# EAGLE design gecko (EAGLE 5.11)

## Sheet 1 of 3
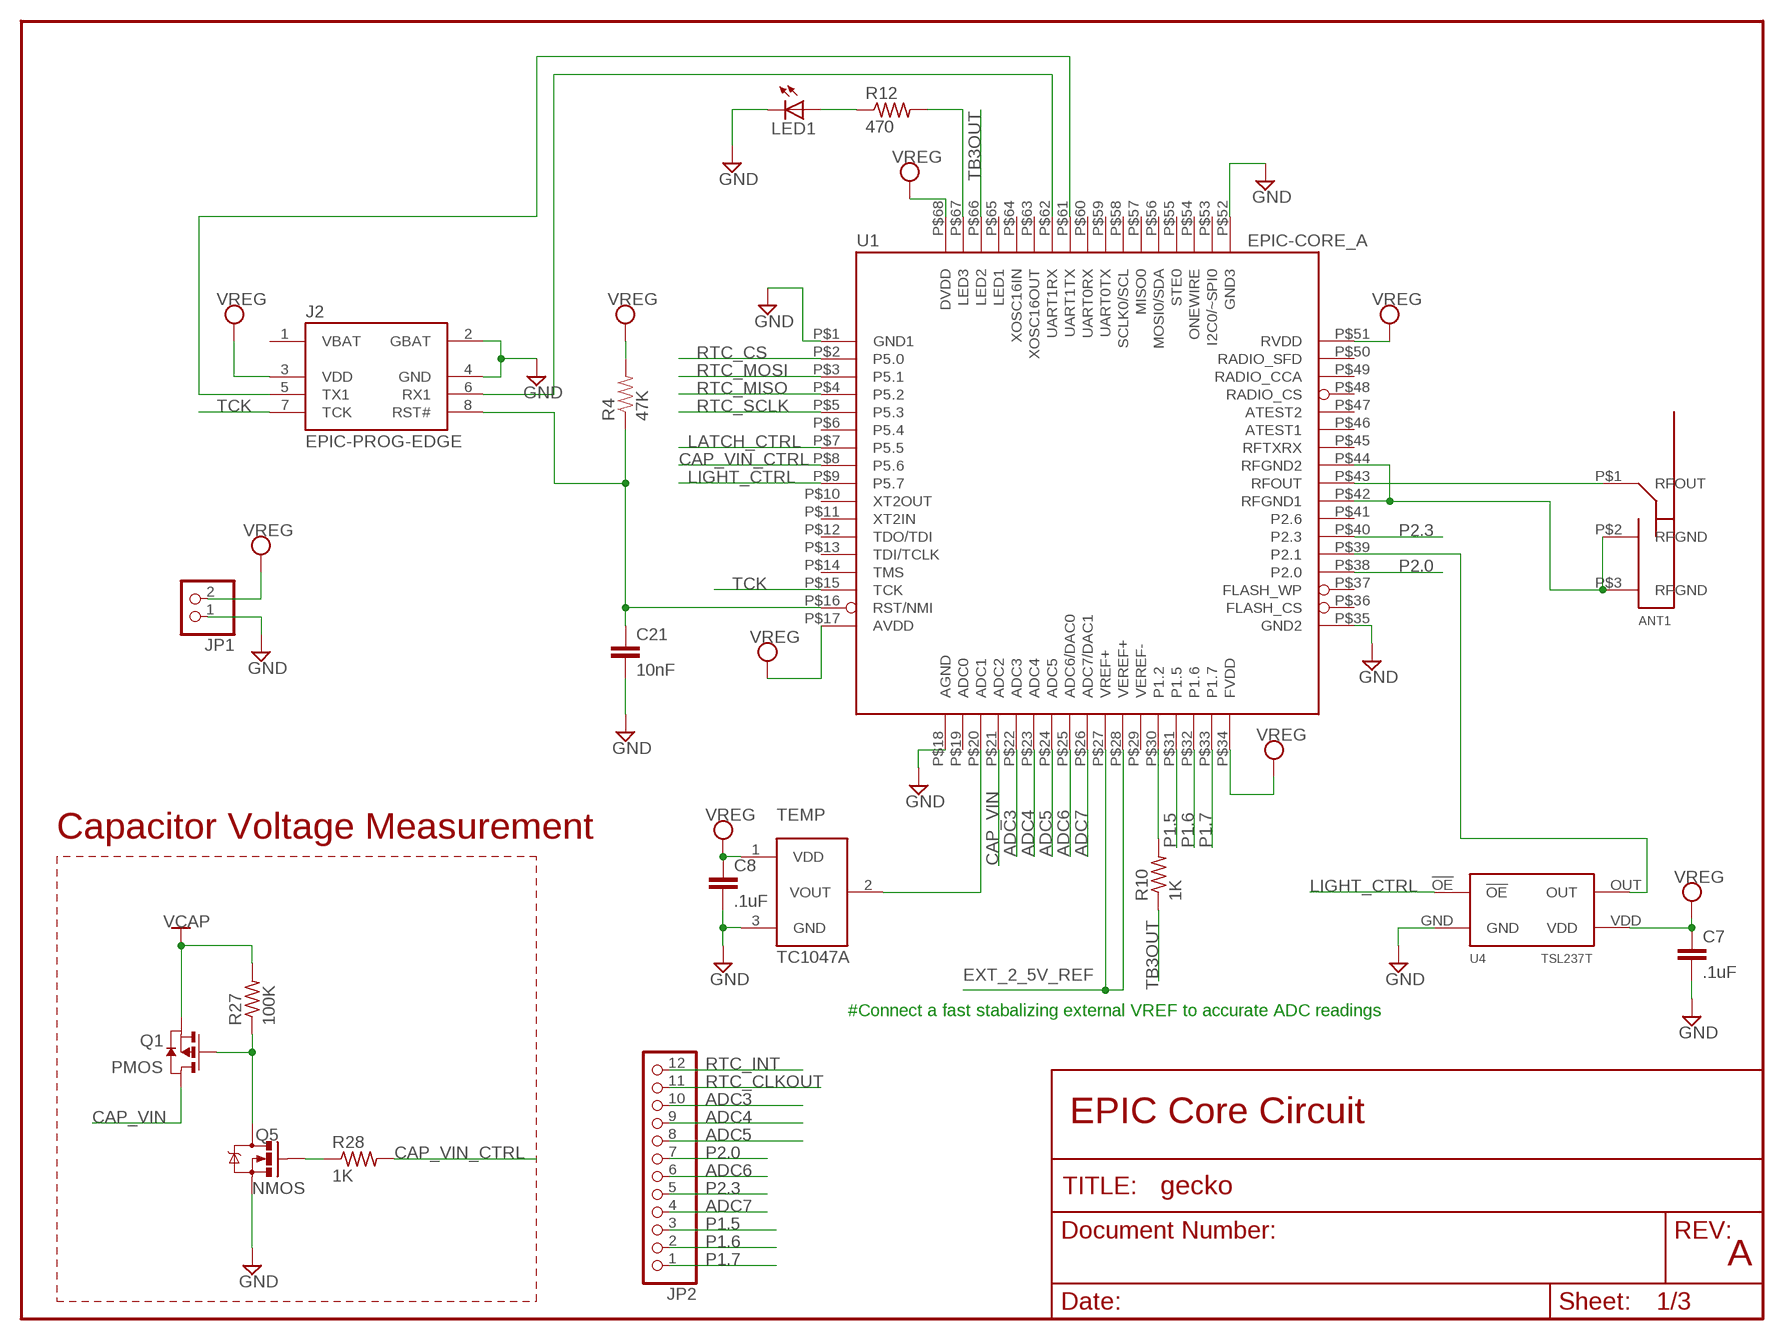
[diagram p0: schematic, sheet 1]

### Parts
ANT1  PIFA-2.4GHZ  [PIFA-2.4GHZ]
C7  .1uF  CAPACITOR  [C0603B]
C8  .1uF  CAPACITOR  [C0603B]
C21  10nF  CAPACITOR  [C0603B]
J2  EPIC-PROG-EDGE  [EPIC-PROG-EDGE]
JP1  PINHD-1X2M  [1X02M]
JP2  PINHD-1X12M  [1X12M]
LED1  LED0603  [LED-0603]
Q1  PMOS  PMOSSOT23  [SOT-23]
Q5  NMOS  MOSFET-NCHANNELSMD  [SOT23-3]
R4  47K  RESISTOR0603-RES  [0603-RES]
R10  1K  RESISTOR  [R0603B]
R12  470  RESISTOR  [R0603B]
R27  100K  RESISTOR  [R0603B]
R28  1K  RESISTOR  [R0603B]
TEMP  TC1047A  [SOT-23-3]
U1  EPIC-CORE_A  [EPIC-LCC68]
U4  TSL237T  [T_4LEAD]

### Nets
ADC3: JP2.10 U1.P$22(ADC3)
ADC4: JP2.9 U1.P$23(ADC4)
ADC5: JP2.8 U1.P$24(ADC5)
ADC6: JP2.6 U1.P$25(ADC6/DAC0)
ADC7: JP2.4 U1.P$26(ADC7/DAC1)
CAP_VIN: Q1.1(D) U1.P$21(ADC2)
CAP_VIN_CTRL: R28.2 U1.P$8(P5.6)
EXT_2_5V_REF: U1.P$27(VREF+) U1.P$28(VEREF+)
GND: C7.2 C8.2 C21.2 J2.2(GBAT) J2.4(GND) JP1.1 LED1.C Q5.2(S) TEMP.3(GND) U1.P$1(GND1) U1.P$18(AGND) U1.P$35(GND2) U1.P$52(GND3) U4.GND ; also sheet 2,3
LATCH_CTRL: U1.P$7(P5.5) ; also sheet 2
LIGHT_CTRL: U1.P$9(P5.7) U4.!OE
LIGHT_FREQ_IN: U1.P$39(P2.1) U4.OUT
N$1: ANT1.P$1(RFOUT) U1.P$43(RFOUT)
N$6: Q1.3(G) Q5.3(D) R27.1
N$7: J2.6(RX1) U1.P$62(UART1RX)
N$8: R10.2 U1.P$30(P1.2)
N$11: J2.5(TX1) U1.P$61(UART1TX)
N$12: Q5.1(G) R28.1
N$14: R12.2 U1.P$67(LED3)
N$15: LED1.A R12.1
N$17: C21.1 J2.8(RST#) R4.1 U1.P$16(RST/NMI)
N$20: TEMP.2(VOUT) U1.P$20(ADC1)
P1.5: JP2.3 U1.P$31(P1.5)
P1.6: JP2.2 U1.P$32(P1.6)
P1.7: JP2.1 U1.P$33(P1.7)
P2.0: JP2.7 U1.P$38(P2.0)
P2.3: JP2.5 U1.P$40(P2.3)
RFGND: ANT1.P$2(RFGND) ANT1.P$3(RFGND) U1.P$42(RFGND1) U1.P$44(RFGND2)
RTC_CLKOUT: JP2.11 ; also sheet 3
RTC_CS: U1.P$2(P5.0) ; also sheet 3
RTC_INT: JP2.12 ; also sheet 2,3
RTC_MISO: U1.P$4(P5.2) ; also sheet 3
RTC_MOSI: U1.P$3(P5.1) ; also sheet 3
RTC_SCLK: U1.P$5(P5.3) ; also sheet 3
TB3OUT: R10.1 U1.P$66(LED2)
TCK: J2.7(TCK) U1.P$15(TCK)
VCAP: Q1.2(S) R27.2 ; also sheet 2
VREG: C7.1 C8.1 J2.3(VDD) JP1.2 R4.2 TEMP.1(VDD) U1.P$17(AVDD) U1.P$34(FVDD) U1.P$51(RVDD) U1.P$68(DVDD) U4.VDD ; also sheet 2,3
Unconnected: J2.1(VBAT) U1.P$6(P5.4) U1.P$10(XT2OUT) U1.P$11(XT2IN) U1.P$12(TDO/TDI) U1.P$13(TDI/TCLK) U1.P$14(TMS) U1.P$19(ADC0) U1.P$29(VEREF-) U1.P$36(FLASH_CS) U1.P$37(FLASH_WP) U1.P$41(P2.6) U1.P$45(RFTXRX) U1.P$46(ATEST1) U1.P$47(ATEST2) U1.P$48(RADIO_CS) U1.P$49(RADIO_CCA) U1.P$50(RADIO_SFD) U1.P$53(I2C0/~SPI0) U1.P$54(ONEWIRE) U1.P$55(STE0) U1.P$56(MOSI0/SDA) U1.P$57(MISO0) U1.P$58(SCLK0/SCL) U1.P$59(UART0TX) U1.P$60(UART0RX) U1.P$63(XOSC16OUT) U1.P$64(XOSC16IN) U1.P$65(LED1)

### Notes on the sheet
- Capacitor Voltage Measurement
- #Connect a fast stabalizing external VREF to accurate ADC readings
- EPIC Core Circuit
- A

## Sheet 2 of 3
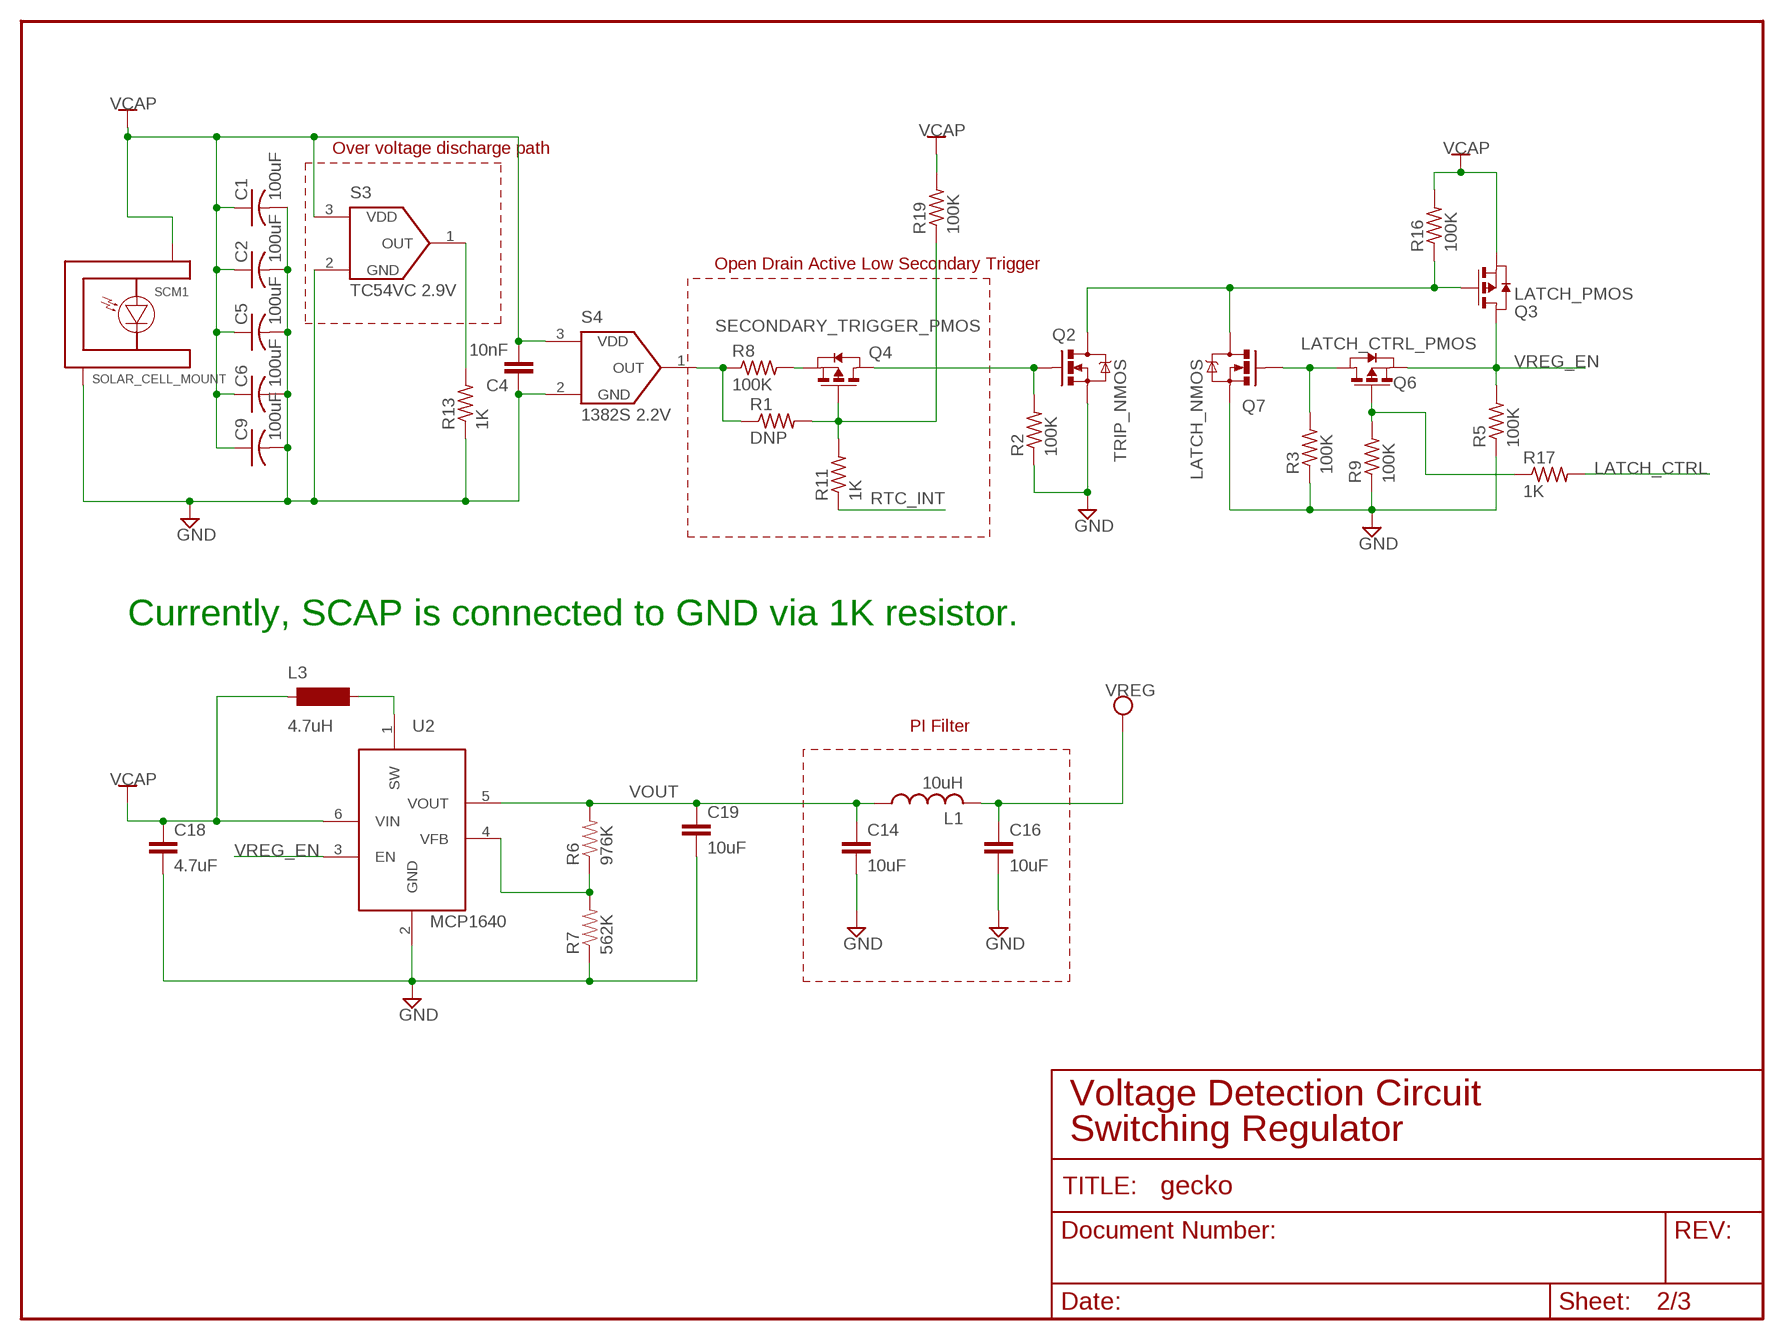
[diagram p1: schematic, sheet 2]

### Parts
C1  100uF  C-USC1206  [C1206]
C2  100uF  C-USC1206  [C1206]
C4  10nF  CAPACITOR  [C0603B]
C5  100uF  C-USC1206  [C1206]
C6  100uF  C-USC1206  [C1206]
C9  100uF  C-USC1206  [C1206]
C14  10uF  CAP0805  [0805]
C16  10uF  CAP0805  [0805]
C18  4.7uF  CAP0603-CAP  [0603-CAP]
C19  10uF  CAP0805  [0805]
L1  10uH  L-USL2012C  [L2012C]
L3  4.7uH  INDUCTOR  [INDUCTOR]
Q2  TRIP_NMOS  MOSFET-NCHANNELSMD  [SOT23-3]
Q3  LATCH_PMOS  PMOSSOT23  [SOT-23]
Q4  SECONDARY_TRIGGER_PMOS  PMOSSOT23  [SOT-23]
Q6  LATCH_CTRL_PMOS  PMOSSOT23  [SOT-23]
Q7  LATCH_NMOS  MOSFET-NCHANNELSMD  [SOT23-3]
R1  DNP  RESISTOR  [R0603B]
R2  100K  RESISTOR  [R0603B]
R3  100K  RESISTOR  [R0603B]
R5  100K  RESISTOR  [R0603B]
R6  976K  RESISTOR0603-RES  [0603-RES]
R7  562K  RESISTOR0603-RES  [0603-RES]
R8  100K  RESISTOR  [R0603B]
R9  100K  RESISTOR  [R0603B]
R11  1K  RESISTOR  [R0603B]
R13  1K  RESISTOR  [R0603B]
R16  100K  RESISTOR  [R0603B]
R17  1K  RESISTOR  [R0603B]
R19  100K  RESISTOR  [R0603B]
S3  TC54VC 2.9V  1382  [SOT-23-3A]
S4  1382S 2.2V  1382  [SOT-23-3A]
SCM1  SOLAR_CELL_MOUNT  [SOLAR_CELL_MOUNT]
U2  MCP1640  [SOT-23-6]

### Nets
GND: C1.2 C2.2 C4.1 C5.2 C6.2 C9.2 C14.2 C16.2 C18.2 C19.2 Q2.2(S) Q7.2(S) R2.1 R3.1 R5.1 R7.1 R9.1 R13.1 S3.2(GND) S4.2(GND) SCM1.NEG U2.2(GND) ; also sheet 1,3
LATCH_CTRL: R17.2 ; also sheet 1
N$2: Q2.1(G) Q4.1(D) R2.2
N$3: L3.2 U2.1(SW)
N$4: R1.1 R8.1 S4.1(OUT)
N$5: R6.1 R7.2 U2.4(VFB)
N$9: Q2.3(D) Q3.3(G) Q7.3(D) R16.1
N$10: Q4.2(S) R8.2
N$13: R13.2 S3.1(OUT)
N$23: Q6.1(D) Q7.1(G) R3.2
N$24: Q6.3(G) R9.2 R17.1
N$25: Q4.3(G) R1.2 R11.2 R19.1
RTC_INT: R11.1 ; also sheet 1,3
VCAP: C1.1 C2.1 C4.2 C5.1 C6.1 C9.1 C18.1 L3.1 Q3.2(S) R16.2 R19.2 S3.3(VDD) S4.3(VDD) SCM1.POS U2.6(VIN) ; also sheet 1
VOUT: C14.1 C19.1 L1.1 R6.2 U2.5(VOUT)
VREG: C16.1 L1.2 ; also sheet 1,3
VREG_EN: Q3.1(D) Q6.2(S) R5.2 U2.3(EN)

### Notes on the sheet
- Over voltage discharge path
- Open Drain Active Low Secondary Trigger
- Currently, SCAP is connected to GND via 1K resistor.
- PI Filter
- Voltage Detection Circuit
- Switching Regulator

## Sheet 3 of 3
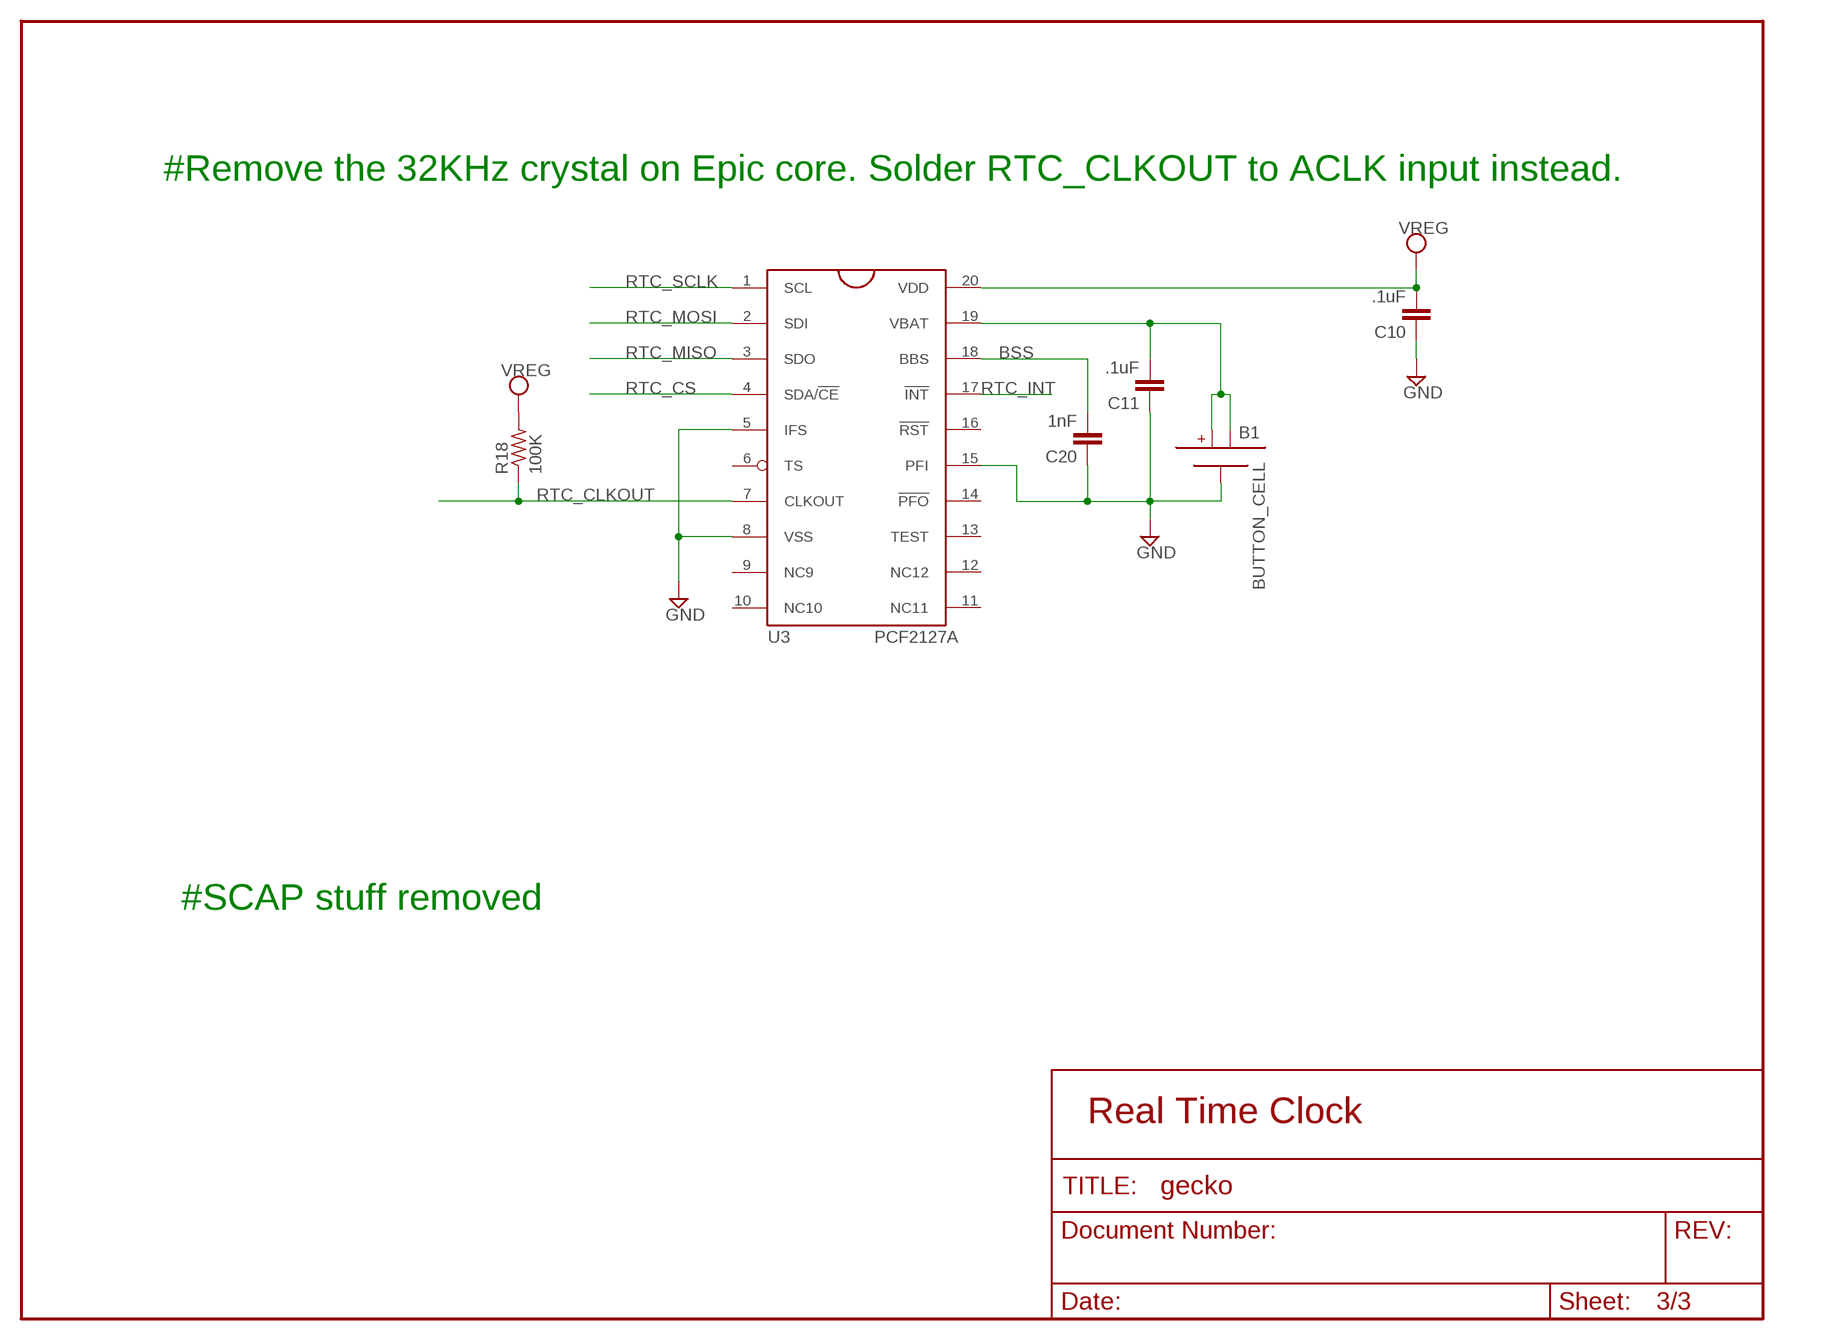
[diagram p2: schematic, sheet 3]

### Parts
B1  BUTTON_CELL  [RETAINER_3000]
C10  .1uF  CAP0603-CAP  [0603-CAP]
C11  .1uF  CAP0603-CAP  [0603-CAP]
C20  1nF  CAP0603-CAP  [0603-CAP]
R18  100K  R-US_R0603  [R0603]
U3  PCF2127A  [SO-20]

### Nets
BSS: C20.2 U3.18(BBS)
GND: B1.NEG C10.1 C11.1 C20.1 U3.5(IFS) U3.8(VSS) U3.15(PFI) ; also sheet 1,2
N$28: B1.POS1 B1.POS2 C11.2 U3.19(VBAT)
RTC_CLKOUT: R18.1 U3.7(CLKOUT) ; also sheet 1
RTC_CS: U3.4(SDA/!CE) ; also sheet 1
RTC_INT: U3.17(!INT) ; also sheet 1,2
RTC_MISO: U3.3(SDO) ; also sheet 1
RTC_MOSI: U3.2(SDI) ; also sheet 1
RTC_SCLK: U3.1(SCL) ; also sheet 1
VREG: C10.2 R18.2 U3.20(VDD) ; also sheet 1,2
Unconnected: U3.6(TS) U3.9(NC9) U3.10(NC10) U3.11(NC11) U3.12(NC12) U3.13(TEST) U3.14(!PFO) U3.16(!RST)

### Notes on the sheet
- #Remove the 32KHz crystal on Epic core. Solder RTC_CLKOUT to ACLK input instead.
- #SCAP stuff removed
- Real Time Clock

## Library data of the parts
ANT1 = berkeley-epic:PIFA-2.4GHZ
B1 = mylibrary:BUTTON_CELL
C1 C2 C5 C6 C9 = rcl:C-US: CAPACITOR, American symbol
C4 C7 C8 C21 = Gecko:CAPACITOR
C10 C11 C14 C16 C18-C20 = SparkFun:CAP: Capacitor Standard 0603 ceramic capacitor, and 0.1" leaded capacitor.
J2 = berkeley-epic:EPIC-PROG-EDGE
JP1 = pinhead:PINHD-1X2: PIN HEADER
JP2 = pinhead:PINHD-1X12: PIN HEADER
L1 = rcl:L-US: INDUCTOR, American symbol
L3 = mylibrary:INDUCTOR
LED1 = SparkFun:LED: LEDs Standard schematic elements and footprints for 5mm, 3mm, 1206, and 0603 sized LEDs. 5mm - Spark Fun Electronics SKU : COM-00529 (and others)
Q1 Q3 Q4 Q6 = berkeley-epic:PMOSSOT23: MOS FET
Q2 Q5 Q7 = SparkFun:MOSFET-NCHANNEL
R1-R3 R5 R8-R13 R16 R17 R19 R27 R28 = Gecko:RESISTOR
R4 R6 R7 = SparkFun:RESISTOR: Resistor Basic schematic elements and footprints for 0603, 1206, and PTH 1/10th watt (small) resistors.
R18 = rcl:R-US_: RESISTOR, American symbol
S3 S4 = Gecko:1382
SCM1 = mylibrary:SOLAR_CELL_MOUNT
TEMP = mylibrary:TC1047A
U1 = berkeley-epic:EPIC-CORE_A
U2 = mylibrary:MCP1640
U3 = mylibrary:PCF2127A
U4 = mylibrary:TSL237T

## Board
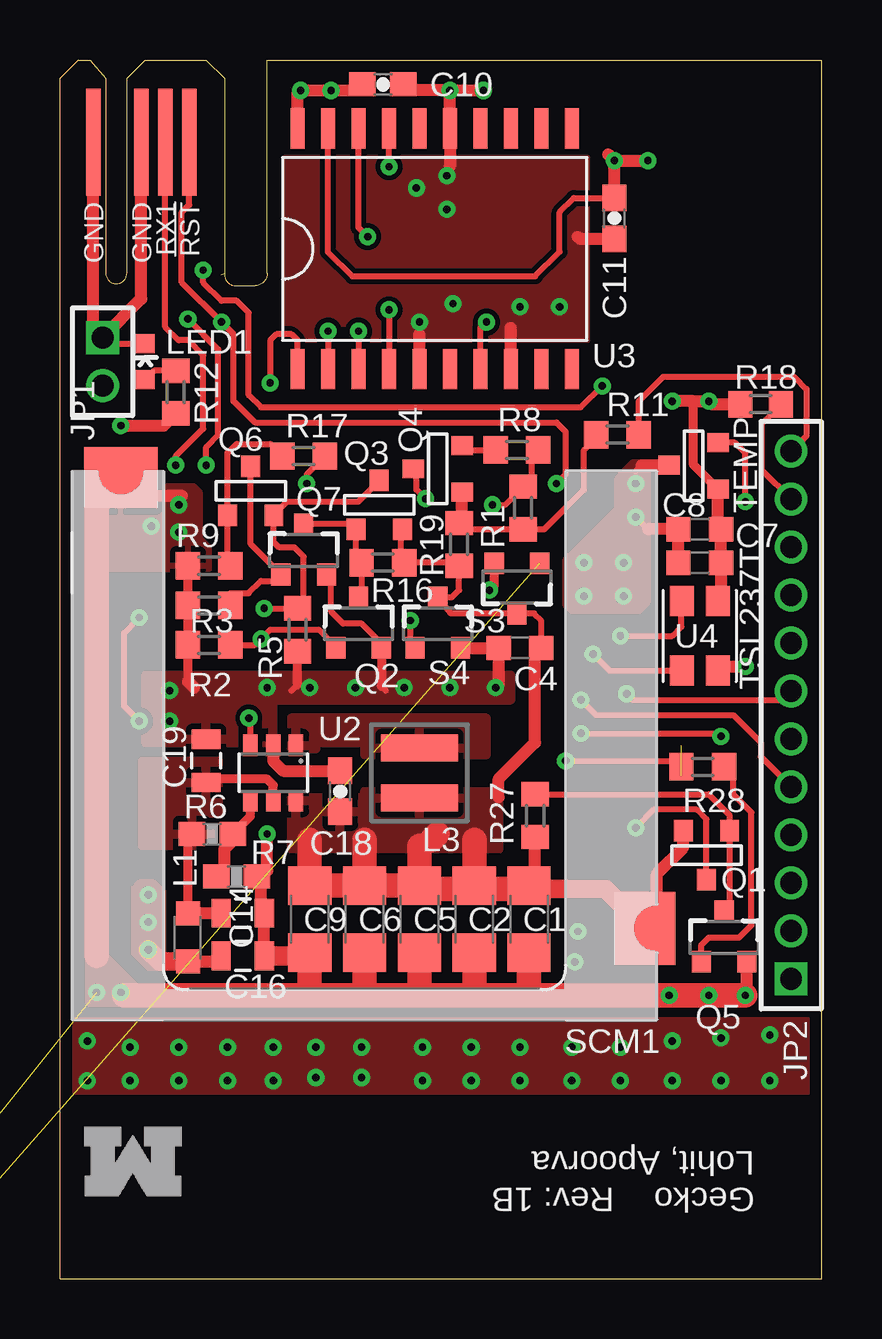
[diagram p3: board, top side]
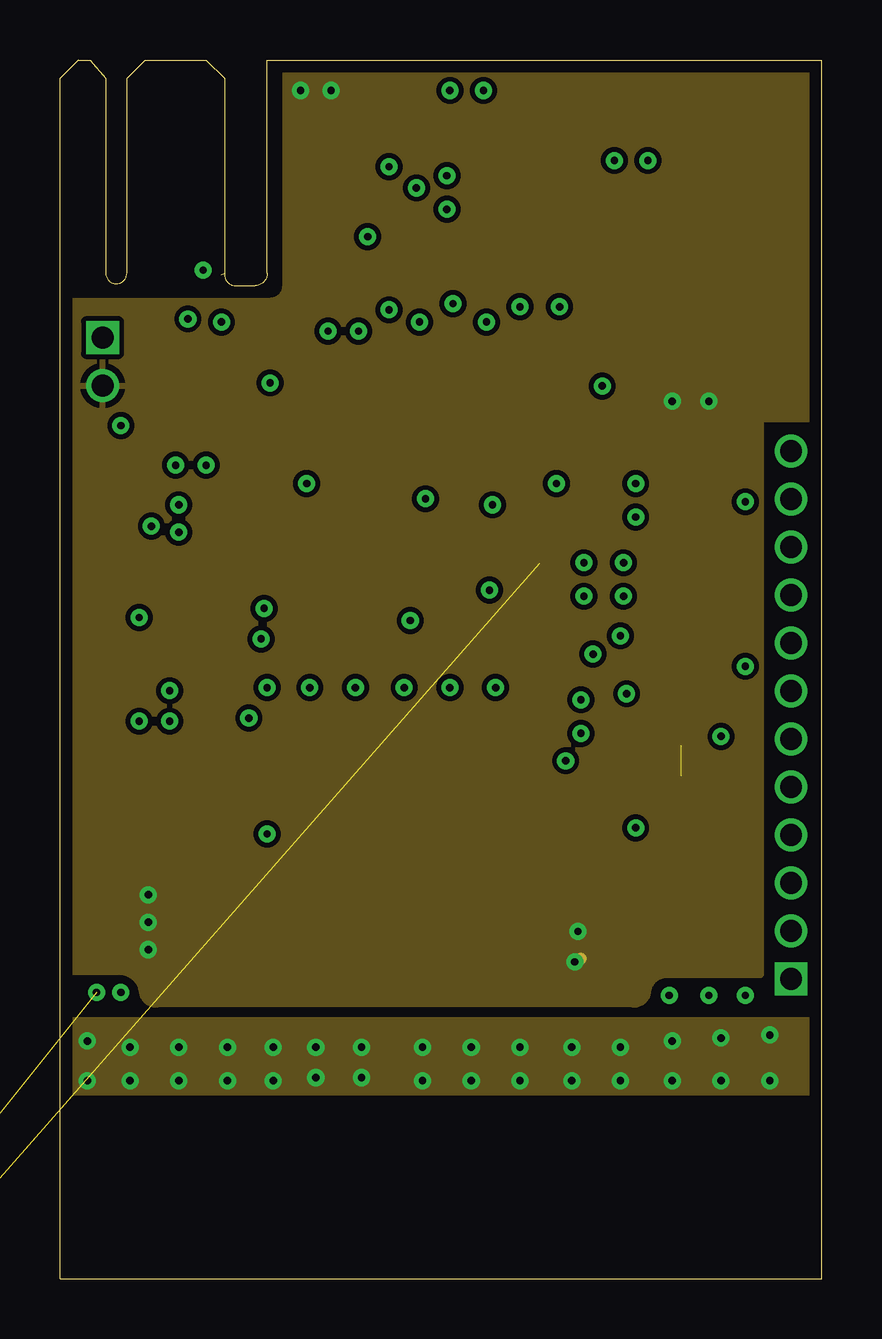
[diagram p4: board, inner layer Power]
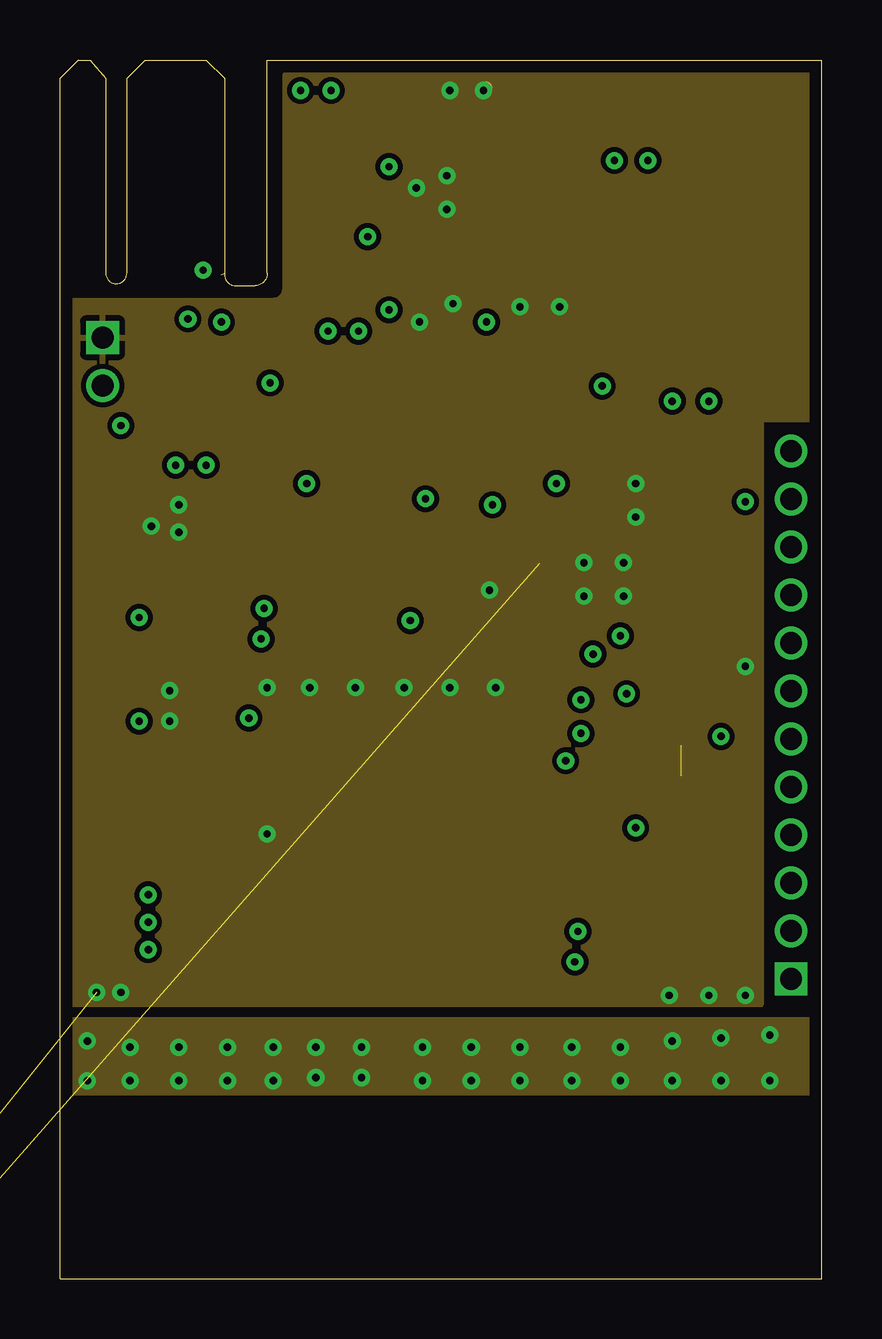
[diagram p5: board, inner layer Ground]
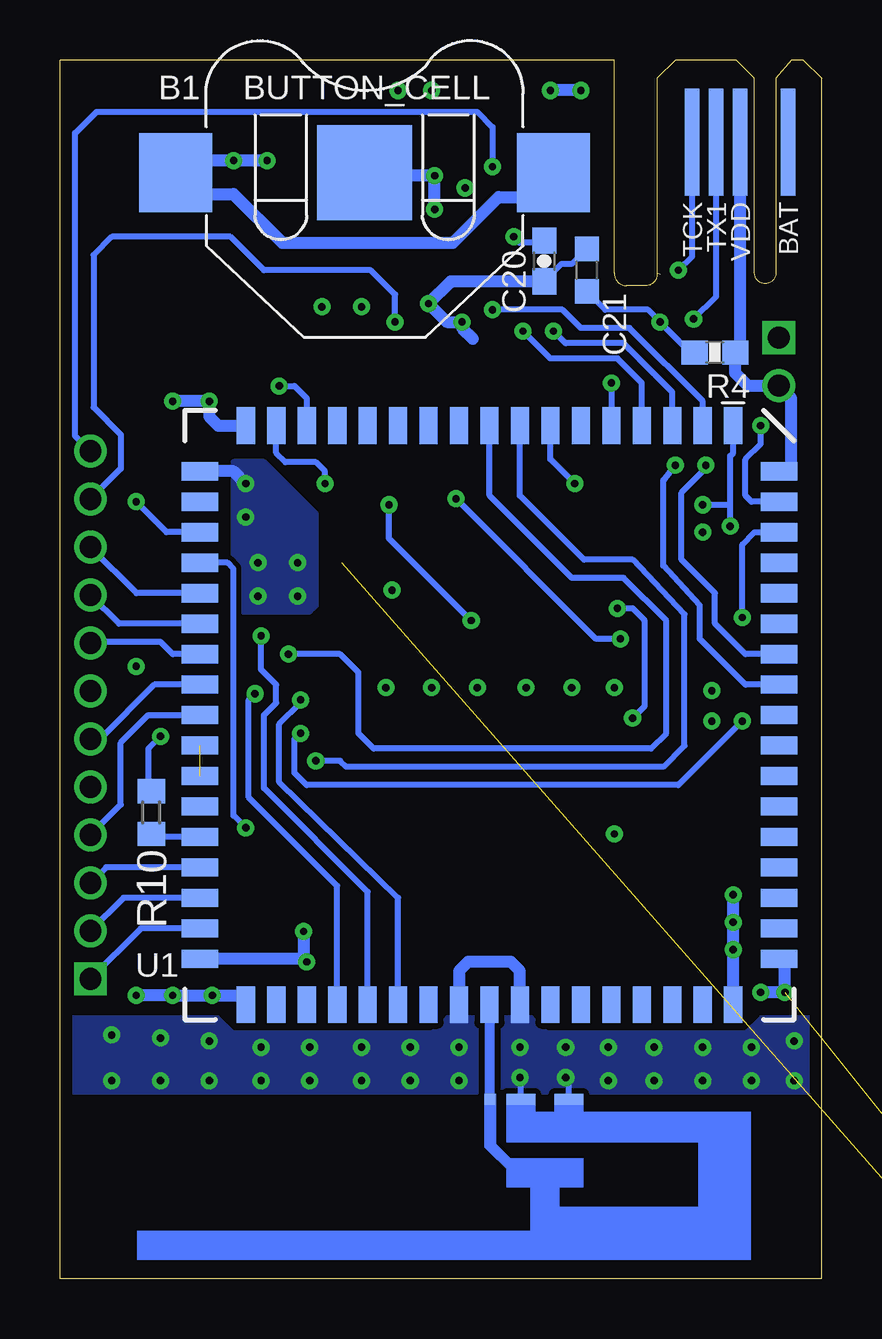
[diagram p6: board, bottom side, seen from below]

Size 31.75 x 50.8 mm. Coordinates in mm from the lower left corner, seen from the top.
Outline: 6.86,41.91 6.86,50.04 6.1,50.8 3.56,50.8 2.79,50.04 2.79,41.91 arc-177 1.91,41.91 1.91,50.04 1.27,50.8 0.76,50.8 0,50.04 0,0 31.75,0 31.75,50.8 8.64,50.8 8.64,41.91 arc-93 8.13,41.39 7.29,41.39 arc-90 6.86,41.91
Outline: 6.72,41.85 6.86,41.91
Copper layers (1+2*15+16): Top 0.0178mm / dielectric 0.3048mm / Power 0.0356mm / dielectric 0.7112mm / Ground 0.0356mm / dielectric 0.3048mm / Bottom 0.0178mm
Design rules "SSC-EAGLE-4Lyr_v1.0.0.3 *": minimum track width 10mil, minimum drill 12mil, track to track 8mil, track to pad 8mil, pad to pad 8mil, via to via 8mil, smd to smd 8mil, copper to edge 20mil, drill to drill 16mil, minimum pad ring 8mil, minimum via ring 8mil, stop-mask expansion 3mil, vias tented up to drill 12mil, thermal gap 10mil

### Footprints (pad centres in the part's own frame; a part is rotated, then mirrored left to right if it is on the bottom)
PIFA-2.4GHZ = smd 0.46 x 0.46: P$1 -2.65,-1.495 | smd 0.46 x 1.2: P$2 -2.655,1.785; P$3 -2.65,-0.215
RETAINER_3000 = smd 3.962 x 3.962: NEG 0,0 | smd 3.048 x 3.302: POS1 -7.874,0; POS2 7.874,0
C1206 = smd 1.6 x 1.8: 1 -1.4,0; 2 1.4,0
C0603B = smd 1.016 x 1.016: 1 -0.889,0; 2 0.889,0
0603-CAP = smd 1.1 x 1: 1 -0.85,0; 2 0.85,0
0805 = smd 0.8 x 1.2: 1 -0.9,0; 2 0.9,0
EPIC-PROG-EDGE = smd 0.61 x 4.445: 1 -1.001,3.619; 3 1.001,3.619; 5 2.002,3.619; 7 3.002,3.619 | smd 0.61 x 4.445 bottom: 2 -1.001,3.619; 4 1.001,3.619; 6 2.002,3.619; 8 3.002,3.619
1X02M = drill 0.914 square: 1 -1,0 | drill 0.914 round: 2 1,0
1X12M = drill 0.914 square: 1 -11,0 | drill 0.914 round: 2 -9,0; 3 -7,0; 4 -5,0; 5 -3,0; 6 -1,0; 7 1,0; 8 3,0; 9 5,0; 10 7,0; 11 9,0; 12 11,0
L2012C = smd 1 x 1: 1 -1,0; 2 1,0
INDUCTOR = smd 1.118 x 3.2: 1 -1.041,0; 2 1.041,0
LED-0603 = smd 0.8 x 0.8: A 0,-0.75; C 0,0.75
SOT-23 = smd 0.787 x 0.889: 1 0.025,-1.016; 2 -0.94,1.016; 3 0.991,1.016
SOT23-3 = smd 0.8 x 0.9: 1 -0.95,-1; 2 0.95,-1; 3 0,1.1
R0603B = smd 1.016 x 1.143: 1 -0.889,0; 2 0.889,0
0603-RES = smd 1.1 x 1: 1 -0.85,0; 2 0.85,0
R0603 = smd 1 x 1.1: 1 -0.85,0; 2 0.85,0
SOT-23-3A = smd 0.8 x 0.9: 1 -0.95,-1; 2 0.95,-1; 3 0,1.1
SOLAR_CELL_MOUNT = smd 2.54 x 3.048: NEG 22.606,22.352 | smd 3.048 x 2.54: POS 3.81,0.508
SOT-23-3 = smd 0.787 x 0.889: 1 -0.991,-1.016; 2 0.94,-1.016; 3 0,1.016
EPIC-LCC68 = smd 1.524 x 0.762: P$1 -12.065,10.16; P$2 -12.065,8.89; P$3 -12.065,7.62; P$4 -12.065,6.35; P$5 -12.065,5.08; P$6 -12.065,3.81; P$7 -12.065,2.54; P$8 -12.065,1.27; P$9 -12.065,0; P$10 -12.065,-1.27; P$11 -12.065,-2.54; P$12 -12.065,-3.81; P$13 -12.065,-5.08; P$14 -12.065,-6.35; P$15 -12.065,-7.62; P$16 -12.065,-8.89; P$17 -12.065,-10.16; P$35 12.065,-10.16; P$36 12.065,-8.89; P$37 12.065,-7.62; P$38 12.065,-6.35; P$39 12.065,-5.08; P$40 12.065,-3.81; P$41 12.065,-2.54; P$42 12.065,-1.27; P$43 12.065,0; P$44 12.065,1.27; P$45 12.065,2.54; P$46 12.065,3.81; P$47 12.065,5.08; P$48 12.065,6.35; P$49 12.065,7.62; P$50 12.065,8.89; P$51 12.065,10.16 | smd 0.762 x 1.524: P$18 -10.16,-12.065; P$19 -8.89,-12.065; P$20 -7.62,-12.065; P$21 -6.35,-12.065; P$22 -5.08,-12.065; P$23 -3.81,-12.065; P$24 -2.54,-12.065; P$25 -1.27,-12.065; P$26 0,-12.065; P$27 1.27,-12.065; P$28 2.54,-12.065; P$29 3.81,-12.065; P$30 5.08,-12.065; P$31 6.35,-12.065; P$32 7.62,-12.065; P$33 8.89,-12.065; P$34 10.16,-12.065; P$52 10.16,12.065; P$53 8.89,12.065; P$54 7.62,12.065; P$55 6.35,12.065; P$56 5.08,12.065; P$57 3.81,12.065; P$58 2.54,12.065; P$59 1.27,12.065; P$60 0,12.065; P$61 -1.27,12.065; P$62 -2.54,12.065; P$63 -3.81,12.065; P$64 -5.08,12.065; P$65 -6.35,12.065; P$66 -7.62,12.065; P$67 -8.89,12.065; P$68 -10.16,12.065
SOT-23-6 = smd 0.6 x 0.9: 1 -0.95,-1.15; 2 0,-1.15; 3 0.95,-1.15; 4 0.95,1.15; 5 0,1.15; 6 -0.95,1.15
SO-20 = smd 1.676 x 0.584: 1 -5.016,5.715; 2 -5.016,4.445; 3 -5.016,3.175; 4 -5.016,1.905; 5 -5.016,0.635; 6 -5.016,-0.635; 7 -5.016,-1.905; 8 -5.016,-3.175; 9 -5.016,-4.445; 10 -5.016,-5.715; 11 5.016,-5.715; 12 5.016,-4.445; 13 5.016,-3.175; 14 5.016,-1.905; 15 5.016,-0.635; 16 5.016,0.635; 17 5.017,1.905; 18 5.016,3.175; 19 5.016,4.445; 20 5.016,5.715
T_4LEAD = smd 1.25 x 1: !OE -1.45,0.75; GND -1.45,-0.75; OUT 1.45,0.75; VDD 1.45,-0.75

### Placement (x,y rotation side)
ANT1  12.32,4.83 270 bottom
B1  19.05,46.1 0 bottom
C1  19.56,14.99 270 top
C2  17.27,14.99 270 top
C4  19.18,26.29 0 top
C5  14.99,14.99 270 top
C6  12.7,14.99 270 top
C7  26.67,29.84 180 top
C8  26.67,31.24 180 top
C9  10.41,14.99 270 top
C10  13.46,49.78 180 top
C11  23.11,44.2 90 top
C14  7.62,15.24 0 top
C16  7.62,13.46 0 top
C18  11.68,20.32 90 top
C19  6.1,21.59 90 top
C20  11.56,42.42 90 bottom
C21  9.78,42.04 90 bottom
J2  2.39,51 180 bottom
JP1  1.78,38.23 270 top
JP2  30.48,23.5 90 top
L1  5.33,14.22 270 top
L3  14.99,21.08 90 top
LED1  3.56,38.23 0 top
Q1  26.92,17.65 0 top
Q2  12.45,27.3 0 top
Q3  13.34,32.26 180 top
Q4  15.75,33.78 270 top
Q5  27.69,14.22 0 top
Q6  7.98,32.84 180 top
Q7  10.16,30.35 0 top
R1  19.3,32.13 270 top
R2  6.22,26.42 0 top
R3  6.22,28.07 0 top
R4  4.45,38.61 0 bottom
R5  9.91,27.05 90 top
R6  6.35,18.54 180 top
R7  7.37,16.76 180 top
R8  19.05,34.54 180 top
R9  6.22,29.72 0 top
R10  27.94,19.43 270 bottom
R11  23.24,35.18 180 top
R12  4.83,36.96 270 top
R13  -7.75,-0.76 0 top  (outside the outline)
R16  13.46,29.84 0 top
R17  10.16,34.29 0 top
R18  29.21,36.45 180 top
R19  16.64,30.61 270 top
R27  19.81,19.3 270 top
R28  26.8,21.34 180 top
S3  19.05,28.83 180 top
S4  15.75,27.3 0 top
SCM1  24.89,10.79 90 top
TEMP  26.42,33.91 90 top
U1  13.84,23.5 270 bottom
U2  8.89,21.08 180 top
U3  15.62,42.93 90 top
U4  26.67,26.8 90 top
U$1  [BLOCK-M]  5.08,6.35 180 top

### Tracks (layer width: path | path; a pad name or v marks a point on that pad's centre or on a via)
ADC3
  Bottom 0.254: U1.P$22 28.56,28.57 JP2.10
ADC4
  Bottom 0.254: U1.P$23 29.29,27.3 JP2.9
ADC5
  Bottom 0.254: U1.P$24 27.05,26.04 27.56,26.54 30.4,26.54 JP2.8
ADC6
  Bottom 0.254: U1.P$25 27.81,24.77 30.08,22.5 JP2.6
ADC7
  Bottom 0.254: U1.P$26 28.07,23.5 29.21,22.35 29.21,19.77 JP2.4
BSS  (via drill 0.3)
  Top 0.254: U3.18 12.45,43.81 v12.83,43.43
  Bottom 0.254: v12.83,43.43 12.57,43.18 11.77,43.18 C20.2
CAP_VIN  (via drill 0.3)
  Top 0.254: Q1.1 26.95,19.15 26.54,19.56 24.77,19.56 v24,18.8
  Bottom 0.254: v24,18.8 24.51,19.3 24.51,29.59 24.77,29.84 U1.P$21
CAP_VIN_CTRL  (via drill 0.3)
  Top 0.254: v21.08,21.59 25.65,21.59 R28.2
  Bottom 0.254: v21.08,21.59 20.07,21.59 19.81,21.34 6.6,21.34 5.71,22.23 5.71,27.69 7.87,29.97 9.91,29.97 12.57,32.64 U1.P$8
EXT_2_5V_REF  (1 unrouted)
GND  (via drill 0.3)  (1 unrouted)
  Top 0.254: 13.4,24.7 13.59,24.51 | 9.65,24.51 9.91,24.77 | Q7.2 11.3,29.03 11.3,27.81 11.81,27.3 12.57,27.3 13.4,26.48 Q2.2 | U3.15 16.38,47.82 | LED1.C 2.03,38.98 JP1.1 | U3.5 14.99,37.85 | U4.GND 27.6,25.53 | 24.51,31.24 v24,31.75 | 24,33.66 24.26,33.91
  Top 0.381: C14.2 8.38,15.61 | 8.38,17.02 R7.1 | S3.2 18.1,28.89 v17.91,28.7 | Q2.2 13.4,24.7 | 9.91,24.77 R5.1 | R9.1 R3.1 R2.1 5.33,24.89
  Top 0.508: U2.2 8.89,21.59 9.31,21.17 C18.2 11.6,21.34 | 8.38,15.61 8.38,16.76 | 8.38,16.76 8.38,17.02 | C16.2 C14.2 | 1.52,27.18 1.61,27.09 | v8.64,18.54 8.64,17.02 8.38,16.76 | Q5.2 28.64,11.88 v28.57,11.81 | 18.29,24.77 C4.1 16.71,26.29 S4.2 | 5.33,24.89 5.59,24.64 | 3.3,32.64 5.08,32.64 | J2.2 1.39,39.23 JP1.1 3.39,40.84 J2.4 | v16.26,49.53 v17.65,49.53 | v16.26,49.53 14.31,49.53 C10.1 | U3.15 v16.26,49.53 | U3.5 14.99,39.37 | U3.8 18.8,39.62 | 16.26,47.88 16.26,46.35 | C11.1 21.68,43.35 21.59,43.43 | 27.6,25.53 v28.57,25.53 | C7.2 C8.2 24.51,31.24 | 24.26,33.91 TEMP.3
  Top 0.762: 26.67,11.81 26.69,11.81
  Top 0.813: C16.2 10.29,13.46 C9.2
  Top 1.016: SCM1.NEG 1.52,32.77 1.52,27.18 1.52,13.46 | 2.67,11.81 10.41,11.81 | 10.41,11.81 12.7,11.81 | 12.7,11.81 14.99,11.81 | 17.27,11.81 19.56,11.81 | 10.41,11.81 C9.2 | 12.7,11.81 C6.2 | 14.99,11.81 C5.2 | 17.27,11.81 C2.2 | 14.99,11.81 17.27,11.81 | 19.56,11.81 C1.2 | 19.56,11.81 26.67,11.81 v27.05,11.81 v28.57,11.81
  Ground 0.254: v24,33.15 24,33.02 | v28.57,25.53 28.7,25.53
  Ground 0.508: v17.65,49.53 17.78,49.66
  Bottom 0.254: U1.P$1 3.68,34.42 3.81,34.29 3.81,32.26 | v3.81,31.37 3.81,32.26 | 3.81,32.26 v4.95,32.26 | C21.2 10.41,42.29 10.83,42.29 C20.1
  Bottom 0.508: U1.P$52 1.52,13.34 v1.52,11.94 v2.54,11.94 | U1.P$35 24,11.81 v25.4,11.81 v27.05,11.81 v28.57,11.81 | 14.54,39.18 14.99,39.62 v14.99,39.88 15.62,39.88 v16.38,40.64 15.46,41.57 C20.1 | B1.NEG 18.92,45.97 v16.13,45.97 v16.13,44.58 | U1.P$18 24.51,33.66 v24,33.15
  other vias: 4.57,24.51 18.16,24.64 16.26,24.64 14.35,24.64 12.32,24.64 10.41,24.64 8.64,24.64 4.57,23.24 4.95,31.11 21.84,29.84 23.5,29.84 23.5,28.45 21.84,28.45 19.18,40.51 20.83,40.51 14.86,45.47
  pour Top: 18.8,24.13 18.8,25.15 3.56,25.15 3.56,22.35 8.89,22.35 8.89,24.13
  pour Ground: 0.25,40.77 8.89,40.77 arc90 9.4,41.27 9.4,50.16 31.62,50.16 31.62,35.81 29.21,35.81 29.21,11.43 0.25,11.43
  pour Top: 1.27,13.46 1.27,11.56 3.05,11.56 3.05,12.19 1.78,13.46
  pour Top: 1.4,33.02 1.4,29.59 6.22,29.59 6.22,30.48 5.84,30.86 5.84,32.77 5.59,33.02
  pour Top: 24.51,33.91 24.51,28.19 24.13,27.81 21.34,27.81 21.08,28.07 21.08,29.97 23.24,32.13 23.24,33.4 23.88,34.04 24.38,34.04
  pour Top: 9.4,46.74 11.18,46.74 11.18,43.43 12.19,42.42 20.7,42.55 20.83,42.67 20.83,44.96 21.97,44.96 21.97,39.12 9.4,39.12
  pour Top: 11.18,46.74 21.97,46.74 21.97,41.66 11.18,41.66
  pour Bottom: 24.51,34.04 24.51,28.19 24.13,27.81 21.34,27.81 21.08,28.07 21.08,31.88 23.24,34.04
LATCH_CTRL  (via drill 0.3)
  Top 0.254: v10.29,33.15 10.29,33.53 R17.2
  Bottom 0.254: v10.29,33.15 11.3,34.16 U1.P$7
LIGHT_CTRL  (via drill 0.3)
  Top 0.254: v22.23,26.04 22.91,25.35 U4.!OE
  Bottom 0.254: v22.23,26.04 20.07,26.04 19.3,25.27 19.3,22.73 18.67,22.1 7.11,22.1 6.48,22.73 6.48,27.43 8.26,29.21 10.41,29.21 13.84,32.64 U1.P$9
LIGHT_FREQ_IN  (via drill 0.3)
  Top 0.254: v23.37,26.8 25.53,26.8 25.91,27.18 25.91,28.23 U4.OUT
  Bottom 0.254: U1.P$39 18.92,16.13 23.24,20.45 23.24,23.5 22.73,24 22.73,24.77 23.37,25.4 v23.37,26.8
N$1
  Bottom 0.409: ANT1.P$1 13.81,11.65
  Bottom 0.508: 13.81,11.65 U1.P$43
N$2  (via drill 0.3)
  Top 0.254: R2.2 8.13,26.42 v8.38,26.67 8.76,27.05 10.79,27.05 11.5,26.35 Q2.1 | Q4.1 14.86,33.53 14.86,32.89 v15.24,32.51
  Bottom 0.254: v8.38,26.67 9.4,26.67 v15.24,32.51
N$3
  pour Top: 10.67,22.1 10.67,22.35 12.7,22.35 12.7,21.84 17.78,21.84 17.78,23.37 9.65,23.37 9.65,22.1
N$4  (via drill 0.3)
  Top 0.254: S4.1 14.61,26.5 v14.61,27.43 | R8.1 19.68,34.29 19.68,33.27 R1.1 18.54,32.26 v18.03,32.26
  Bottom 0.254: v14.61,27.43 18.03,30.86 v18.03,32.26
N$5
  Top 0.381: U2.4 7.94,19.28 R6.1
  Top 0.508: R7.2 6.86,17.11 6.86,17.91 7.2,18.25 R6.1
N$6
  Top 0.254: Q5.3 27.91,15.73 Q1.3 27.91,19.33 27.05,20.19 R27.1
N$7  (via drill 0.3)
  Top 0.254: v4.83,33.91 4.83,34.29 5.97,35.43 5.97,38.48 5.33,39.12 4.95,39.12 4.39,39.67 J2.6
  Bottom 0.254: U1.P$62 3.17,26.04 4.45,27.3 4.45,28.57 5.84,29.97 5.84,32.77 4.83,33.78 v4.83,33.91
N$8
  Bottom 0.254: U1.P$30 27.81,18.41 R10.2
N$9
  Top 0.254: Q2.3 12.57,28.66 R16.1 12.34,30.2 Q3.3 12.05,31.45 Q7.3
N$10
  Top 0.254: Q4.2 16.94,34.54 R8.2
N$11  (via drill 0.3)
  Top 0.254: v6.1,33.91 6.1,34.67 6.6,35.18 6.6,38.73 v5.33,40.01
  Bottom 0.254: U1.P$61 3.17,24.77 5.08,26.67 5.08,28.07 6.6,29.72 6.6,33.27 v6.1,33.91 | J2.5 4.39,40.95 v5.33,40.01
N$12
  Top 0.254: Q5.1 26.74,13.91 27.05,14.22 28.32,14.22 28.83,14.73 28.83,19.43 28.07,20.19 28.07,21.08 R28.1
N$13  (1 unrouted)
N$14  (via drill 0.3)
  Top 0.508: v2.54,35.56 4.32,35.56 R12.2
  Bottom 0.254: U1.P$67 2.92,32.38 3.17,32.64 3.17,34.16 2.54,34.8 v2.54,35.56
N$15
  Top 0.254: R12.1 3.92,37.85 LED1.A
N$17  (via drill 0.3)
  Top 0.254: v20.7,33.15 21.08,33.53 21.08,35.31 20.7,35.69 8.13,35.69 7.24,36.58 7.24,39.37 v6.73,39.88 5.08,41.53 5.08,44.45 5.39,44.77 J2.8
  Bottom 0.254: v20.7,33.15 20.7,33.66 21.08,34.04 22.35,34.04 22.73,34.42 U1.P$16 | R4.1 5.46,38.61 v6.73,39.88 7.24,40.39 9.02,40.39 C21.1
N$20  (via drill 0.3)
  Top 0.254: TEMP.2 28.14,34.85 28.57,34.42 v28.57,32.38
  Bottom 0.254: v28.57,32.38 27.3,31.11 U1.P$20
N$23
  Top 0.254: Q6.1 7.95,30.61 Q7.1 8.94,29.08 8.38,29.08 7.87,28.57 7.11,28.57 R3.2
N$24
  Top 0.254: R9.2 6.99,29.97 Q6.3 6.99,34.42 7.37,34.8 8.76,34.8 R17.1
N$25
  Top 0.254: R19.1 16.89,31.24 R1.2 20.19,31.24 21.84,32.89 21.84,34.54 22.35,35.05 R11.2
  Top 0.508: R19.1 16.76,31.75 Q4.3
N$28  (via drill 0.3)
  Top 0.254: U3.19 11.18,42.8 12.19,41.78 19.81,41.78 20.83,42.8 20.83,44.45 21.42,45.05 C11.2
  Top 0.508: v23.11,46.61 22.86,46.86 | v23.11,46.61 v24.51,46.61 | C11.2 v23.11,46.61
  Bottom 0.508: v23.11,46.61 26.42,46.61 B1.POS1 26.92,45.72 26.42,45.21 24.51,45.21 22.48,43.18 15.37,43.18 13.46,45.09 12.19,45.09 B1.POS2
P1.5
  Bottom 0.254: U1.P$31 29.83,17.14 JP2.3
P1.6
  Bottom 0.254: U1.P$32 29.1,15.88 JP2.2
P1.7
  Bottom 0.254: U1.P$33 28.37,14.61 JP2.1
P2.0  (via drill 0.3)
  Top 0.254: v23.62,24.38 23.88,24.13 30.11,24.13 JP2.7
  Bottom 0.254: U1.P$38 20.19,16.38 23.88,20.07 23.88,24.13 v23.62,24.38
P2.3  (via drill 0.3)
  Top 0.254: v21.72,24.13 22.35,23.5 28.07,23.5 29.21,22.35 29.21,21.77 JP2.5
  Bottom 0.254: U1.P$40 17.65,15.88 22.61,20.7 22.61,23.11 21.72,24 v21.72,24.13
RFGND  (via drill 0.3)
  Bottom 0.254: ANT1.P$3 12.53,8.22 v12.57,8.38 | ANT1.P$2 10.53,8.25 v10.67,8.38
  Bottom 0.508: U1.P$44 12.57,12.83 12.95,13.21 14.73,13.21 15.11,12.83 U1.P$42
  other vias: 6.99,8.26 4.95,9.65 6.99,9.65 8.89,9.65 17.14,9.65 19.18,9.65 21.34,9.65 23.37,9.65 25.53,9.91 27.56,10.03 27.56,8.26 25.53,8.26 23.37,8.26 21.34,8.26 19.18,8.26 17.14,8.26 15.11,8.26 4.95,8.26 2.92,8.26 8.89,8.26 15.11,9.65 12.57,9.65 10.67,9.65 2.92,9.65 1.14,9.91 1.14,8.26 29.59,10.16 29.59,8.26
  pour Bottom (isolate 0.254, no thermals): 0.25,10.92 2.54,10.92 3.17,10.29 11.43,10.29 12.06,10.92 15.62,10.92 16.26,10.29 24.51,10.29 25.15,10.92 31.75,10.92 31.72,7.75 0.23,7.75
  pour Top: 0.25,10.67 31.5,10.67 31.5,7.92 0.28,7.92
  pour Power: 0.25,10.67 31.5,10.67 31.5,7.87 0.25,7.87
  pour Ground (rank 2): 0.25,10.67 31.5,10.67 31.5,7.87 0.25,7.87
RTC_CLKOUT  (via drill 0.3)
  Top 0.254: U3.7 17.53,39.62 v17.78,39.88 | R18.1 29.27,35.65 29.27,33.71 JP2.11
  Bottom 0.254: JP2.11 29.21,33.77 29.21,35.18 30.35,36.32 30.35,42.67 29.59,43.43 24.64,43.43 23.24,42.04 18.8,42.04 17.78,41.02 v17.78,39.88
RTC_CS  (via drill 0.3)
  Top 0.254: v13.72,40.39 U3.4
  Bottom 0.254: U1.P$2 4.95,36.58 8,39.62 10.03,39.62 10.79,40.39 v13.72,40.39
RTC_INT  (via drill 0.3)
  Top 0.254: R11.1 24.13,36.58 25.15,37.59 30.61,37.59 31.11,37.08 31.11,35.13 JP2.12 | v13.72,46.35 U3.17
  Bottom 0.254: JP2.12 31.11,35.13 31.11,47.75 30.23,48.64 14.35,48.64 13.72,48.01 v13.72,46.35
RTC_MISO  (via drill 0.3)
  Top 0.254: v12.45,39.5 U3.3
  Bottom 0.254: U1.P$4 7.49,37.34 8.51,38.35 11.3,38.35 v12.45,39.5
RTC_MOSI  (via drill 0.3)
  Top 0.254: v11.18,39.5 U3.2
  Bottom 0.254: U1.P$3 6.22,36.96 8.26,38.99 10.67,38.99 v11.18,39.5
RTC_SCLK  (via drill 0.3)
  Top 0.254: v8.76,37.34 8.76,39.12 9.02,39.37 9.65,39.37 9.91,39.12 U3.1
  Bottom 0.254: v8.76,37.34 U1.P$5
TB3OUT  (via drill 0.3)
  Top 0.254: v3.3,27.56 2.67,26.92 2.67,23.88 v3.3,23.24 | v21.72,22.73 27.43,22.73 v27.56,22.61
  Bottom 0.254: U1.P$66 2.79,31.11 3.3,30.61 v3.3,27.56 | v3.3,23.24 5.97,20.57 21.46,20.57 21.97,21.08 21.97,22.48 v21.72,22.73 | 28.19,20.07 R10.1 28.07,20.32 28.07,22.1 v27.56,22.61
TCK  (via drill 0.3)
  Top 0.254: v5.97,42.04 5.97,41.53 6.73,40.77 7.37,40.77 7.87,40.26 7.87,36.83 8.38,36.32 21.72,36.32 v22.61,37.21
  Bottom 0.254: J2.7 5.39,42.61 v5.97,42.04 | v22.61,37.21 21.97,37.21 21.46,36.7 U1.P$15
VCAP
  Top 0.254: C4.2 20.07,27.43 19.77,27.73 S3.3 16.3,27.73 S4.3 16.34,28.41 16.64,28.7 R19.2 16.51,29.84 R16.2 14.22,29.97 14.22,30.99 14.15,31.19 Q3.2
  Top 0.406: C2.1 17.27,16.51 | 19.56,16.26 C1.1 | C5.1 14.99,16.51 | C6.1 12.7,16.51
  Top 0.508: C1.1 19.81,16.64 R27.2 | 18.29,20.07 18.29,20.83 19.81,22.35 19.81,26.29 C4.2 20.19,26.16 | Q1.2 25.98,17.98 24.89,16.89 24.89,15.11 SCM1.POS
  Top 0.762: 19.56,16.26 22.73,16.26 SCM1.POS
  Top 1.016: C9.1 C6.1 C5.1 15.11,16.39 15.24,16.26 19.56,16.26 | 12.7,16.51 12.7,18.29 | 14.99,16.51 14.99,18.03 | 17.27,16.51 17.27,18.29 | 15.75,18.54 15.49,18.29 | 10.41,16.51 10.41,18.29
  pour Top: 18.29,17.91 9.65,17.91 9.65,20.07 12.7,20.07 12.7,20.32 18.29,20.32
VOUT
  Top 0.381: U2.5 8.89,20.57 8.64,20.83 6.49,20.83 C19.1 | 5.35,15.24 5.35,18.39 R6.2
  Top 0.508: C14.1 5.35,15.24 L1.1
  pour Top: 6.6,18.03 3.43,18.03 3.43,21.59 6.6,21.59
VREG  (via drill 0.3)
  Top 0.254: 27.56,28.39 U4.VDD
  Top 0.381: TEMP.1 26.42,33.93 26.42,36.58
  Top 0.508: L1.2 6.48,13.22 C16.1 | C10.2 12.32,49.53 v11.3,49.53 v10.03,49.53 9.91,49.4 U3.20 | R18.2 27.18,36.45 v27.05,36.58 26.42,36.58 v25.53,36.58 | 27.56,28.39 C7.1 C8.1 27.43,31.37 TEMP.1
  Top 0.762: 4.17,13.22 L1.2
  Top 0.813: v3.68,13.72 4.17,13.22
  Power 0.508: v21.46,13.21 21.72,13.34
  Bottom 0.508: U1.P$51 v3.68,13.72 v3.68,14.86 v3.68,16 | 21.59,13.34 U1.P$34 | v21.59,14.48 21.59,13.34 | 21.59,13.34 v21.46,13.21 | v10.03,49.53 v11.3,49.53 | J2.3 3.39,38.81 R4.2 3.6,37.76 3.05,37.21 1.79,37.21 | 1.79,37.21 JP1.2 | 1.79,37.21 1.27,36.69 1.27,33.78 1.4,33.66 U1.P$68 | U1.P$17 25.15,35.56 25.53,35.94 v25.53,36.58 v27.05,36.58
  pour Power: 0.25,40.77 8.76,40.77 arc90 9.4,41.4 9.4,50.42 31.62,50.16 31.62,35.81 29.21,35.81 29.21,12.65 25.35,12.65 arc90 24.51,11.94 arc-90 23.88,11.43 4.06,11.43 arc-90 3.43,11.94 arc90 2.34,12.78 0.38,12.78
  pour Top: 3.05,16.26 3.05,13.59 3.68,12.95 4.32,12.95 4.32,16.13 3.94,16.51 3.3,16.51
VREG_EN  (via drill 0.3)
  Top 0.254: U2.3 7.94,23.3 v7.87,23.37 | v8.51,27.94 R5.2 10.16,28.19 10.16,30.1 9.78,30.48 9.14,30.48 8.91,30.71 Q6.2 9.47,32.38 12.45,32.38 13.31,33.25 Q3.1
  Bottom 0.254: v7.87,23.37 7.37,23.88 7.37,27.43 7.87,27.94 v8.51,27.94

### Text on the board
tPlace: Lohit, Apoorva | Rev: 1B | Gecko